# Altium schematic sheet Shaheen.SchDoc
size A2
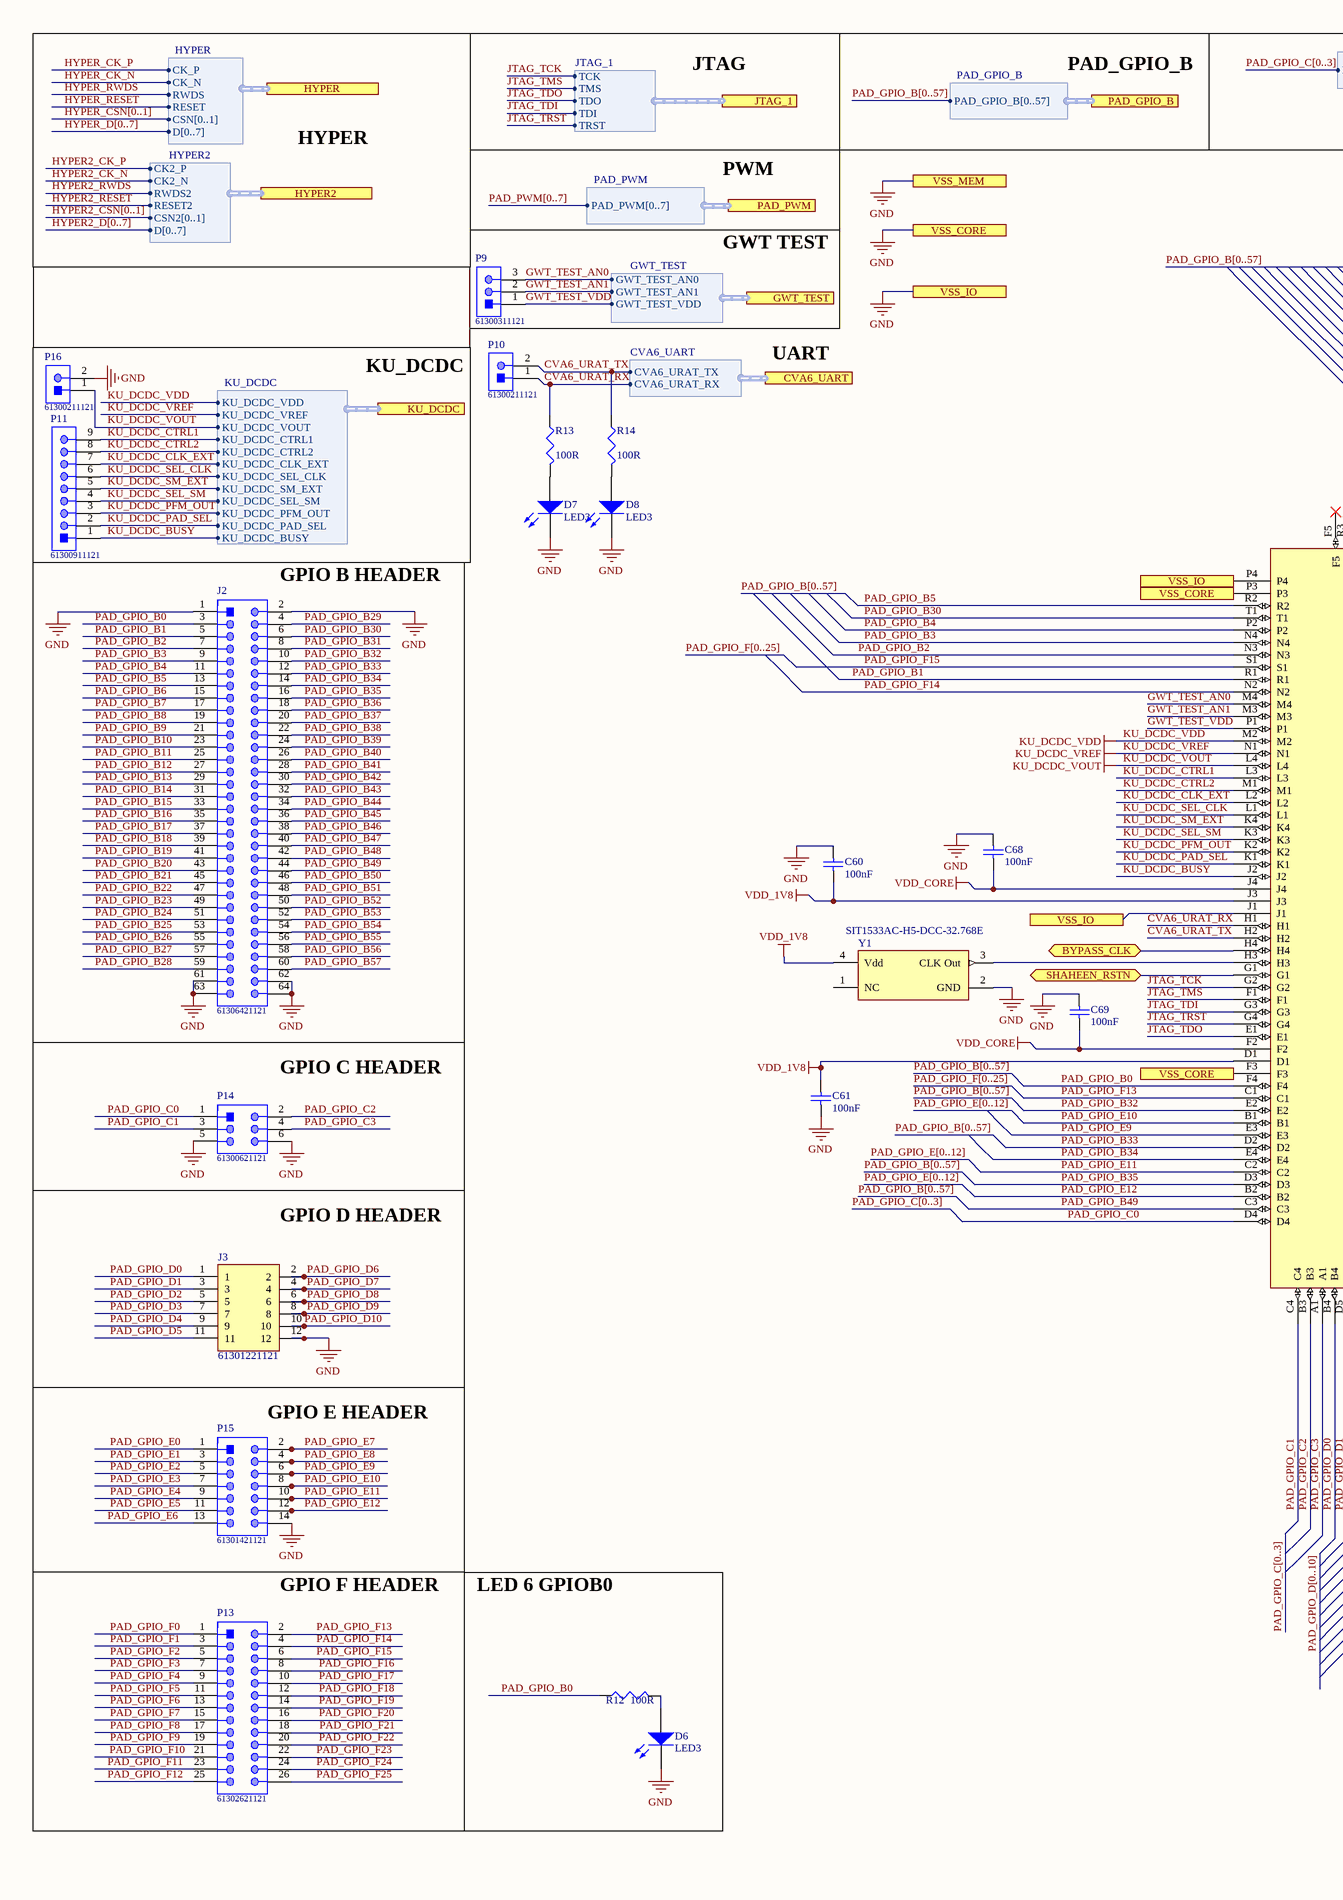
[diagram p0: Shaheen.SchDoc, left]
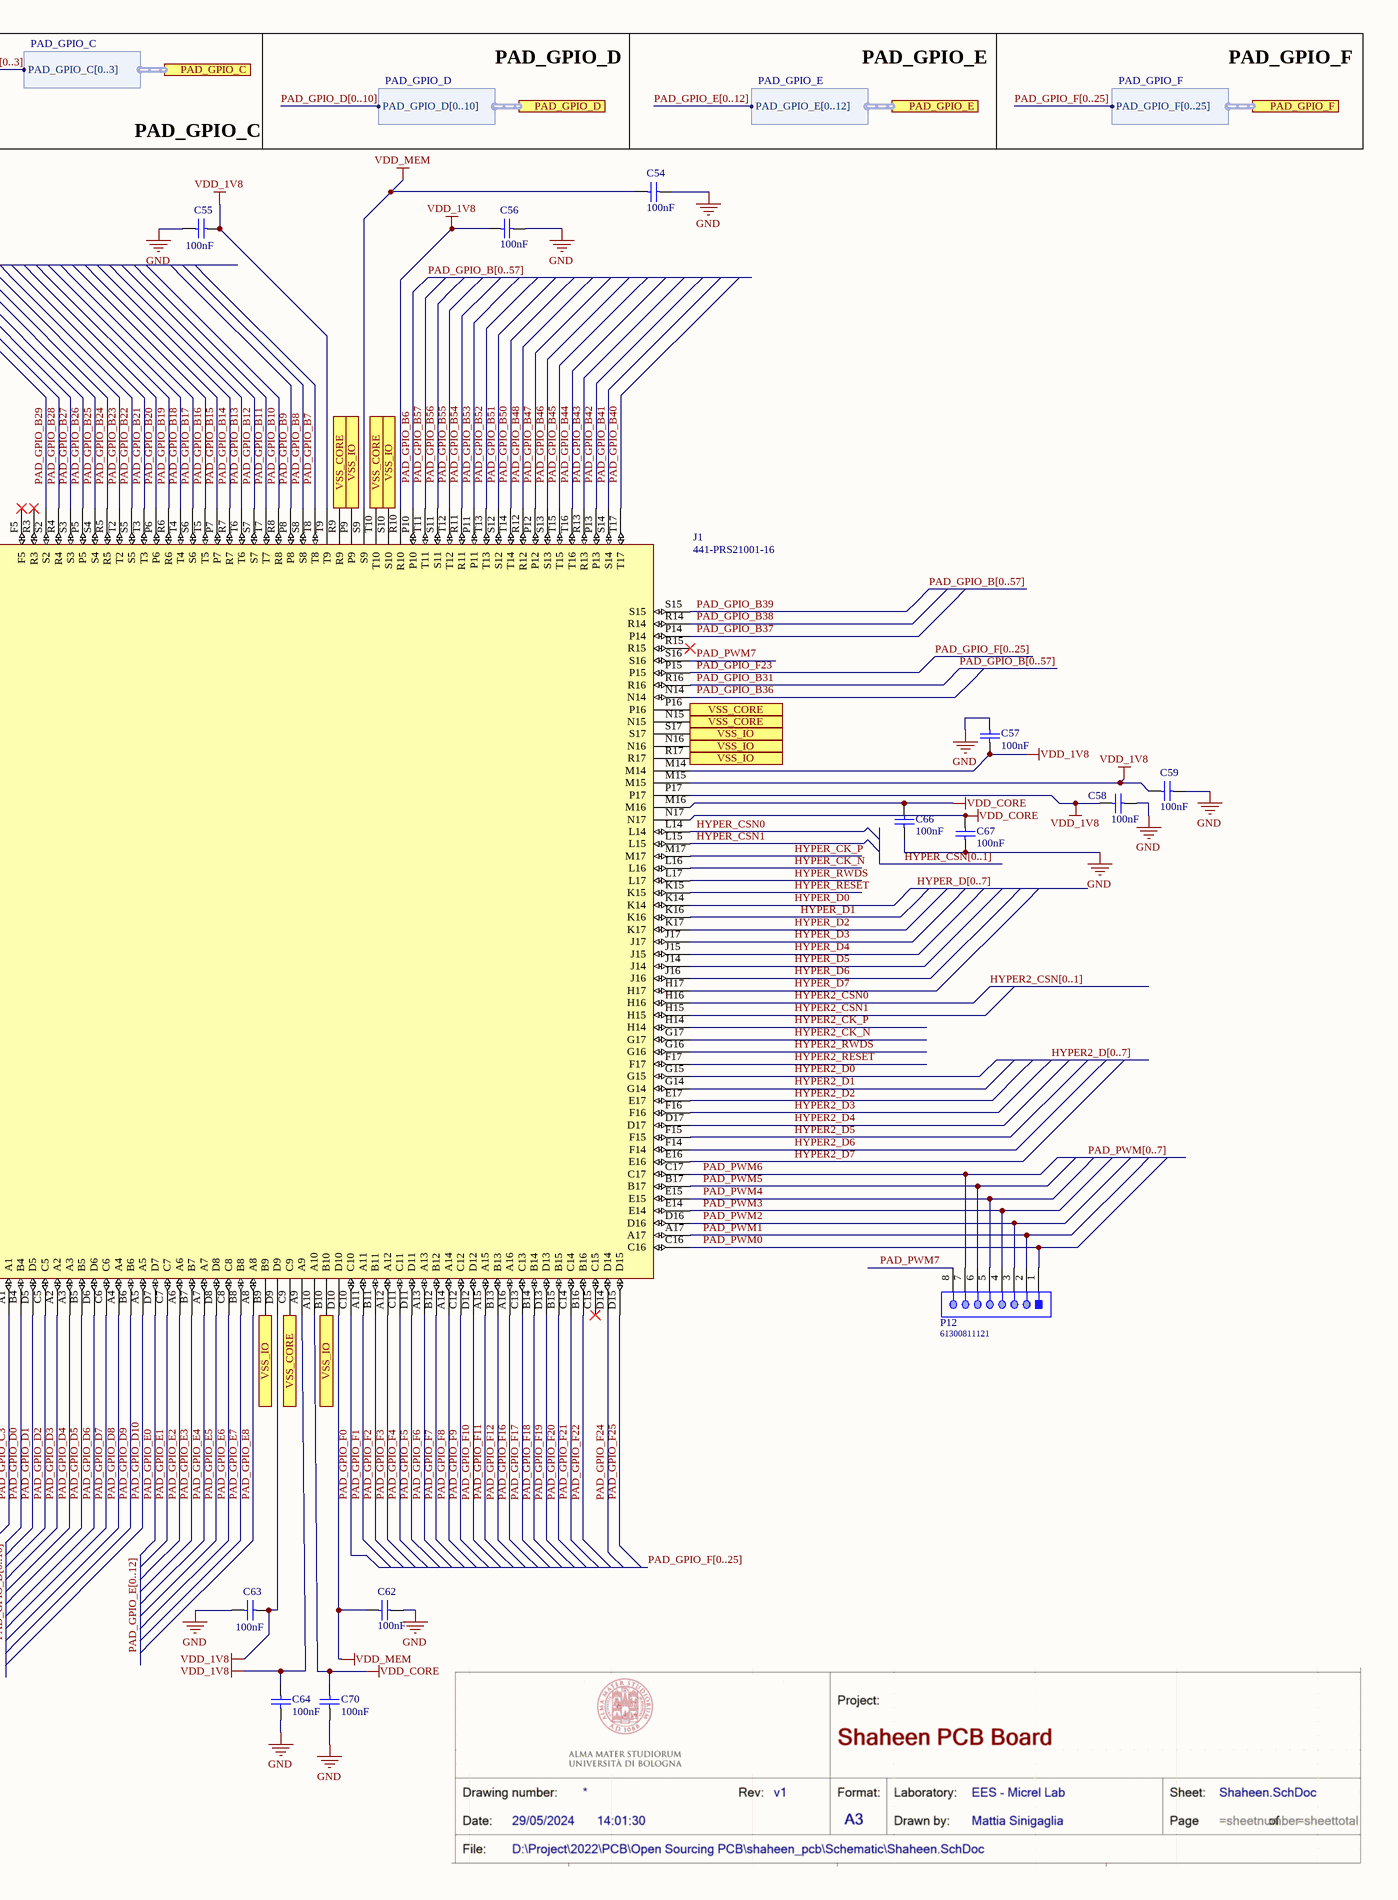
[diagram p1: Shaheen.SchDoc, right]

## Parts
C54  value 100nF  [0603]  (hidden comment: Cap)
C55  value 100nF  [0603]  (hidden comment: Cap)
C56  value 100nF  [0603]  (hidden comment: Cap)
C57  value 100nF  [0603]  (hidden comment: Cap)
C58  value 100nF  [0603]  (hidden comment: Cap)
C59  value 100nF  [0603]  (hidden comment: Cap)
C60  value 100nF  [0603]  (hidden comment: Cap)
C61  value 100nF  [0603]  (hidden comment: Cap)
C62  value 100nF  [0603]  (hidden comment: Cap)
C63  value 100nF  [0603]  (hidden comment: Cap)
C64  value 100nF  [0603]  (hidden comment: Cap)
C66  value 100nF  [0603]  (hidden comment: Cap)
C67  value 100nF  [0603]  (hidden comment: Cap)
C68  value 100nF  [0603]  (hidden comment: Cap)
C69  value 100nF  [0603]  (hidden comment: Cap)
C70  value 100nF  [0603]  (hidden comment: Cap)
D6  LED3  [0603]
D7  LED3  [0603]
D8  LED3  [0603]
J1  441-PRS21001-16  [441PRS2100116]
J2  61306421121  [61306421121]
J3  61301221121  [HDRV12W64P254_2X6_1524X508X889P]
P9  61300311121  [61300311121]
P10  61300211121  [61300211121]
P11  61300911121  [61300911121]
P12  61300811121  [61300811121]
P13  61302621121  [61302621121]
P14  61300621121  [61300621121]
P15  61301421121  [61301421121]
P16  61300211121  [61300211121]
R12  value 100R  [J1-0603]  (hidden comment: Res3)
R13  value 100R  [res_0402_R - modified]  (hidden comment: Res3)
R14  value 100R  [res_0402_R - modified]  (hidden comment: Res3)
Y1  SIT1533AC-H5-DCC-32.768E  [FP-SiT1533-H-MFG]

## Ports
BYPASS_CLK (bidir), CVA6_UART (harness CVA6_UART), GWT_TEST (harness GWT_TEST), HYPER2 (harness HYPER2), HYPER (harness HYPER), JTAG_1 (harness JTAG_1), KU_DCDC (harness KU_DCDC), PAD_GPIO_B (harness PAD_GPIO_B), PAD_GPIO_C (harness PAD_GPIO_C), PAD_GPIO_D (harness PAD_GPIO_D), PAD_GPIO_E (harness PAD_GPIO_E), PAD_GPIO_F (harness PAD_GPIO_F), PAD_PWM (harness PAD_PWM), SHAHEEN_RSTN (bidir), VSS_CORE, VSS_IO, VSS_MEM

## Harnesses
JTAG_1: TRST, TDI, TDO, TMS, TCK
HYPER2: D[0..7], CK2_P, CK2_N, RWDS2, CSN2[0..1], RESET2
HYPER: CK_N, CK_P, RWDS, CSN[0..1], D[0..7], RESET
CVA6_UART: CVA6_URAT_RX, CVA6_URAT_TX
PAD_GPIO_B: PAD_GPIO_B[0..57]
KU_DCDC: KU_DCDC_VDD, KU_DCDC_VREF, KU_DCDC_VOUT, KU_DCDC_CTRL1, KU_DCDC_CTRL2, KU_DCDC_CLK_EXT, KU_DCDC_SEL_CLK, KU_DCDC_SM_EXT, KU_DCDC_SEL_SM, KU_DCDC_PFM_OUT, KU_DCDC_PAD_SEL, KU_DCDC_BUSY
PAD_GPIO_C: PAD_GPIO_C[0..3]
PAD_GPIO_D: PAD_GPIO_D[0..10]
PAD_GPIO_E: PAD_GPIO_E[0..12]
PAD_GPIO_F: PAD_GPIO_F[0..25]
PAD_PWM: PAD_PWM[0..7]
GWT_TEST: GWT_TEST_VDD, GWT_TEST_AN1, GWT_TEST_AN0

## Nets
GND: C54.2 C55.2 C56.2 C57.2 C58.2 C59.1 C60.2 C61.2 C62.1 C63.2 C64.2 C66.1 C67.2 C68.2 C69.2 C70.2 D6.2(K) D7.2(K) D8.2(K) J1.B9 J1.B10 J1.C9 J1.F3 J1.J1 J1.N15 J1.N16 J1.P3 J1.P4 J1.P9 J1.P16 J1.R9 J1.R17 J1.S10 J1.S17 J1.T10 J2.1 J2.2 J2.61 J2.62 J2.63 J2.64 J3.12 P14.5 P14.6 P15.14 P16.2 Y1.2(GND) ; port VSS_MEM, port VSS_CORE, port VSS_IO
KU_DCDC_VDD: J1.M2 ; port KU_DCDC.KU_DCDC_VDD
KU_DCDC_VOUT: J1.L4 P16.1 ; port KU_DCDC.KU_DCDC_VOUT
KU_DCDC_VREF: J1.N1 ; port KU_DCDC.KU_DCDC_VREF
VDD_1V8: C55.1 C56.1 C57.1 C58.1 C59.2 C60.1 C61.1 C63.1 C64.1 J1.A9 J1.D1 J1.D9 J1.J3 J1.M14 J1.M15 J1.P17 J1.R10 J1.T9 Y1.4(Vdd)
VDD_CORE: C66.2 C67.1 C68.1 C69.1 C70.1 J1.A10 J1.F2 J1.J4 J1.M16 J1.N17
VDD_MEM: C54.1 C62.2 J1.D10 J1.S9
BYPASS_CLK: J1.H4 ; port BYPASS_CLK
CVA6_URAT_RX: J1.H1 P10.1 R13.1 ; port CVA6_UART.CVA6_URAT_RX
CVA6_URAT_TX: J1.H2 P10.2 R14.1 ; port CVA6_UART.CVA6_URAT_TX
GWT_TEST_AN0: J1.M4 P9.3 ; port GWT_TEST.GWT_TEST_AN0
GWT_TEST_AN1: J1.M3 P9.2 ; port GWT_TEST.GWT_TEST_AN1
GWT_TEST_VDD: J1.P1 P9.1 ; port GWT_TEST.GWT_TEST_VDD
HYPER2_CK_N: J1.G17 ; port HYPER2.CK2_N
HYPER2_CK_P: J1.H14 ; port HYPER2.CK2_P
HYPER2_CSN0: J1.H16
HYPER2_CSN1: J1.H15
HYPER2_D0: J1.G15
HYPER2_D1: J1.G14
HYPER2_D2: J1.E17
HYPER2_D3: J1.F16
HYPER2_D4: J1.D17
HYPER2_D5: J1.F15
HYPER2_D6: J1.F14
HYPER2_D7: J1.E16
HYPER2_RESET: J1.F17 ; port HYPER2.RESET2
HYPER2_RWDS: J1.G16 ; port HYPER2.RWDS2
HYPER_CK_N: J1.L16 ; port HYPER.CK_N
HYPER_CK_P: J1.M17 ; port HYPER.CK_P
HYPER_CSN0: J1.L14
HYPER_CSN1: J1.L15
HYPER_D0: J1.K14
HYPER_D1: J1.K16
HYPER_D2: J1.K17
HYPER_D3: J1.J17
HYPER_D4: J1.J15
HYPER_D5: J1.J14
HYPER_D6: J1.J16
HYPER_D7: J1.H17
HYPER_RESET: J1.K15 ; port HYPER.RESET
HYPER_RWDS: J1.L17 ; port HYPER.RWDS
JTAG_TCK: J1.G2 ; port JTAG_1.TCK
JTAG_TDI: J1.G3 ; port JTAG_1.TDI
JTAG_TDO: J1.E1 ; port JTAG_1.TDO
JTAG_TMS: J1.F1 ; port JTAG_1.TMS
JTAG_TRST: J1.G4 ; port JTAG_1.TRST
KU_DCDC_BUSY: J1.J2 P11.1 ; port KU_DCDC.KU_DCDC_BUSY
KU_DCDC_CLK_EXT: J1.L2 P11.7 ; port KU_DCDC.KU_DCDC_CLK_EXT
KU_DCDC_CTRL1: J1.L3 P11.9 ; port KU_DCDC.KU_DCDC_CTRL1
KU_DCDC_CTRL2: J1.M1 P11.8 ; port KU_DCDC.KU_DCDC_CTRL2
KU_DCDC_PAD_SEL: J1.K1 P11.2 ; port KU_DCDC.KU_DCDC_PAD_SEL
KU_DCDC_PFM_OUT: J1.K2 P11.3 ; port KU_DCDC.KU_DCDC_PFM_OUT
KU_DCDC_SEL_CLK: J1.L1 P11.6 ; port KU_DCDC.KU_DCDC_SEL_CLK
KU_DCDC_SEL_SM: J1.K3 P11.4 ; port KU_DCDC.KU_DCDC_SEL_SM
KU_DCDC_SM_EXT: J1.K4 P11.5 ; port KU_DCDC.KU_DCDC_SM_EXT
PAD_GPIO_B0: J1.F4 J2.3 R12.1
PAD_GPIO_B1: J1.R1 J2.5
PAD_GPIO_B2: J1.N3 J2.7
PAD_GPIO_B3: J1.N4 J2.9
PAD_GPIO_B4: J1.P2 J2.11
PAD_GPIO_B5: J1.R2 J2.13
PAD_GPIO_B6: J1.P10 J2.15
PAD_GPIO_B7: J1.T8 J2.17
PAD_GPIO_B8: J1.S8 J2.19
PAD_GPIO_B9: J1.P8 J2.21
PAD_GPIO_B10: J1.R8 J2.23
PAD_GPIO_B11: J1.T7 J2.25
PAD_GPIO_B12: J1.S7 J2.27
PAD_GPIO_B13: J1.T6 J2.29
PAD_GPIO_B14: J1.R7 J2.31
PAD_GPIO_B15: J1.P7 J2.33
PAD_GPIO_B16: J1.T5 J2.35
PAD_GPIO_B17: J1.S6 J2.37
PAD_GPIO_B18: J1.T4 J2.39
PAD_GPIO_B19: J1.R6 J2.41
PAD_GPIO_B20: J1.P6 J2.43
PAD_GPIO_B21: J1.T3 J2.45
PAD_GPIO_B22: J1.S5 J2.47
PAD_GPIO_B23: J1.T2 J2.49
PAD_GPIO_B24: J1.R5 J2.51
PAD_GPIO_B25: J1.S4 J2.53
PAD_GPIO_B26: J1.P5 J2.55
PAD_GPIO_B27: J1.S3 J2.57
PAD_GPIO_B28: J1.R4 J2.59
PAD_GPIO_B29: J1.S2 J2.4
PAD_GPIO_B30: J1.T1 J2.6
PAD_GPIO_B31: J1.R16 J2.8
PAD_GPIO_B32: J1.E2 J2.10
PAD_GPIO_B33: J1.D2 J2.12
PAD_GPIO_B34: J1.E4 J2.14
PAD_GPIO_B35: J1.D3 J2.16
PAD_GPIO_B36: J1.N14 J2.18
PAD_GPIO_B37: J1.P14 J2.20
PAD_GPIO_B38: J1.R14 J2.22
PAD_GPIO_B39: J1.S15 J2.24
PAD_GPIO_B40: J1.T17 J2.26
PAD_GPIO_B41: J1.S14 J2.28
PAD_GPIO_B42: J1.P13 J2.30
PAD_GPIO_B43: J1.R13 J2.32
PAD_GPIO_B44: J1.T16 J2.34
PAD_GPIO_B45: J1.T15 J2.36
PAD_GPIO_B46: J1.S13 J2.38
PAD_GPIO_B47: J1.P12 J2.40
PAD_GPIO_B48: J1.R12 J2.42
PAD_GPIO_B49: J1.C3 J2.44
PAD_GPIO_B50: J1.T14 J2.46
PAD_GPIO_B51: J1.S12 J2.48
PAD_GPIO_B52: J1.T13 J2.50
PAD_GPIO_B53: J1.P11 J2.52
PAD_GPIO_B54: J1.R11 J2.54
PAD_GPIO_B55: J1.T12 J2.56
PAD_GPIO_B56: J1.S11 J2.58
PAD_GPIO_B57: J1.T11 J2.60
PAD_GPIO_C0: J1.D4 P14.1
PAD_GPIO_C1: J1.C4 P14.3
PAD_GPIO_C2: J1.B3 P14.2
PAD_GPIO_C3: J1.A1 P14.4
PAD_GPIO_D0: J1.B4 J3.1
PAD_GPIO_D1: J1.D5 J3.3
PAD_GPIO_D2: J1.C5 J3.5
PAD_GPIO_D3: J1.A2 J3.7
PAD_GPIO_D4: J1.A3 J3.9
PAD_GPIO_D5: J1.B5 J3.11
PAD_GPIO_D6: J1.D6 J3.2
PAD_GPIO_D7: J1.C6 J3.4
PAD_GPIO_D8: J1.A4 J3.6
PAD_GPIO_D9: J1.B6 J3.8
PAD_GPIO_D10: J1.A5 J3.10
PAD_GPIO_E0: J1.D7 P15.1
PAD_GPIO_E1: J1.C7 P15.3
PAD_GPIO_E2: J1.A6 P15.5
PAD_GPIO_E3: J1.B7 P15.7
PAD_GPIO_E4: J1.A7 P15.9
PAD_GPIO_E5: J1.D8 P15.11
PAD_GPIO_E6: J1.C8 P15.13
PAD_GPIO_E7: J1.B8 P15.2
PAD_GPIO_E8: J1.A8 P15.4
PAD_GPIO_E9: J1.E3 P15.6
PAD_GPIO_E10: J1.B1 P15.8
PAD_GPIO_E11: J1.C2 P15.10
PAD_GPIO_E12: J1.B2 P15.12
PAD_GPIO_F0: J1.C10 P13.1
PAD_GPIO_F1: J1.A11 P13.3
PAD_GPIO_F2: J1.B11 P13.5
PAD_GPIO_F3: J1.A12 P13.7
PAD_GPIO_F4: J1.C11 P13.9
PAD_GPIO_F5: J1.D11 P13.11
PAD_GPIO_F6: J1.A13 P13.13
PAD_GPIO_F7: J1.B12 P13.15
PAD_GPIO_F8: J1.A14 P13.17
PAD_GPIO_F9: J1.C12 P13.19
PAD_GPIO_F10: J1.D12 P13.21
PAD_GPIO_F11: J1.A15 P13.23
PAD_GPIO_F12: J1.B13 P13.25
PAD_GPIO_F13: J1.C1 P13.2
PAD_GPIO_F14: J1.N2 P13.4
PAD_GPIO_F15: J1.S1 P13.6
PAD_GPIO_F16: J1.A16 P13.8
PAD_GPIO_F17: J1.C13 P13.10
PAD_GPIO_F18: J1.B14 P13.12
PAD_GPIO_F19: J1.D13 P13.14
PAD_GPIO_F20: J1.B15 P13.16
PAD_GPIO_F21: J1.C14 P13.18
PAD_GPIO_F22: J1.B16 P13.20
PAD_GPIO_F23: J1.P15 P13.22
PAD_GPIO_F24: J1.D14 P13.24
PAD_GPIO_F25: J1.D15 P13.26
PAD_PWM0: J1.C16 P12.1
PAD_PWM1: J1.A17 P12.2
PAD_PWM2: J1.D16 P12.3
PAD_PWM3: J1.E14 P12.4
PAD_PWM4: J1.E15 P12.5
PAD_PWM5: J1.B17 P12.6
PAD_PWM6: J1.C17 P12.7
PAD_PWM7: J1.S16 P12.8
SHAHEEN_RSTN: J1.G1 ; port SHAHEEN_RSTN
NetD6_1: D6.1(A) R12.2
NetD7_1: D7.1(A) R13.2
NetD8_1: D8.1(A) R14.2
NetJ1_H3: J1.H3 Y1.3(CLK_Out)

Not connected (* = marked no-connect by the designer): J1 C15* F5* R3* R15*; Y1 1(NC)

## Buses and harness runs
bus HYPER2_CSN[0..1]
bus HYPER2_D[0..7]
bus HYPER_CSN[0..1]
bus HYPER_D[0..7]
bus PAD_GPIO_B[0..57]
bus PAD_GPIO_C[0..3]
bus PAD_GPIO_D[0..10]
bus PAD_GPIO_E[0..12]
bus PAD_GPIO_F[0..25]
bus PAD_PWM[0..7]

## Notes on the sheet
- JTAG
- PAD_GPIO_B
- PAD_GPIO_D
- PAD_GPIO_E
- PAD_GPIO_F
- HYPER
- PAD_GPIO_C
- PWM
- GWT TEST
- KU_DCDC
- UART
- (near J2) GPIO B HEADER
- (near P14) GPIO C HEADER
- GPIO D HEADER
- (near P15) GPIO E HEADER
- GPIO F HEADER
- LED 6 GPIOB0

## Library data of the parts
C54-C64 C66-C70 = Cap: Capacitor; Published: 8-Jun-2000; LatestRevisionDate: 17-Jul-2002; LatestRevisionNote: Re-released for DXP Platform.; PackageReference: RAD-0.3; Publisher: Altium Limited; PackageDescription: Radial Cap, Thru-Hole; 2 Leads; 0.3 in Pin Spacing
D6-D8 = LED3: Typical BLUE SiC LED; Published: 8-Jun-2000; LatestRevisionDate: 17-Dec-2003; LatestRevisionNote: PCB Footprint replaced.; DatasheetVersion: 16-Apr-2002; PackageVersion: 16-Apr-2002; PackageReference: 3.5X2.8X1.9; Publisher: Altium Limited; PackageDescription: SM LED; 2 C-Bend Leads; Body 3.5 x 2.8 x 1.9 mm, inc leads (LxWxH typ)
J1 = 441-PRS21001-16: Connector; Manufacturer_Name: ARIES; Datasheet Link: https://www.mouser.it/datasheet/2/35/10004_pga_zif_test_and_burn_in_socket-1225760.pdf; Height: 10.92mm; Manufacturer_Part_Number: 441-PRS21001-16; Mouser Part Number: 535-441-PRS21001-16; Mouser Price/Stock: https://www.mouser.co.uk/ProductDetail/Aries-Electronics/441-PRS21001-16?qs=qSpSzuzdqG3uVfRDOHdDNQ%3D%3D
J2 = CMP-1502-01138-1: THT Vertical Pin Header WR-PHD, Pitch 2.54 mm, Dual Row, 64 pins; Manufacturer: Wurth Elektronik; Withstanding Voltage: 500VAC; Rated Current: 3A; Gender: Male; Pin Number: 64; Working Voltage: 250VAC; Contact Resistance: 20mOhm; Pitch: 2.54mm; Orientation: Vertical; Manufacturer URL: http://www.we-online.de; Package Reference: 61306421121; Operating Temperature: -40to105degC; Part Number: 61306421121; Row Number: Dual; Datasheet URL: https://katalog.we-online.de/em/datasheet/6130xx21121.pdf; Mounting Technology: THT; Publisher: WurthElektronik; Packaging: Bag
J3 = 61301221121: Connector; Manufacturer_Name: Wurth Elektronik; Datasheet Link: https://componentsearchengine.com//61301221121.pdf; Height: 8.89mm; Mouser2 Part Number: 710-61301221121; Mouser2 Price/Stock: https://www.mouser.com/Search/Refine.aspx?Keyword=710-61301221121; Manufacturer_Part_Number: 61301221121
P9 = CMP-1502-01062-1: THT Vertical Pin Header WR-PHD, Pitch 2.54 mm, Single Row, 3 pins; Manufacturer: Wurth Elektronik; Withstanding Voltage: 500VAC; Working Voltage: 250VAC; Rated Current: 3A; Pitch: 2.54mm; Pin Number: 3; Gender: Male; Contact Resistance: 20mOhm; Package Reference: 61300311121; Manufacturer URL: http://www.we-online.de; Datasheet URL: https://katalog.we-online.de/em/datasheet/6130xx11121.pdf; Operating Temperature: -40to105degC; Part Number: 61300311121; Orientation: Vertical; Packaging: Bag; Row Number: Single; Mounting Technology: THT; Publisher: WurthElektronik
P10 P16 = CMP-1712-00002-4: THT Vertical Pin Header WR-PHD, Pitch 2.54 mm, Single Row, 2 pins; Manufacturer: Wurth Elektronik; Rated Current: 3A; Gender: Male; Withstanding Voltage: 500VAC; Working Voltage: 250VAC; Pitch: 2.54mm; Contact Resistance: 20mOhm; Pin Number: 2; Mounting Technology: THT; Orientation: Vertical; Operating Temperature: -40to105degC; Packaging: Bag; Publisher: WurthElektronik; Datasheet URL: https://katalog.we-online.de/em/datasheet/6130xx11121.pdf; Manufacturer URL: http://www.we-online.de; Row Number: Single; Package Reference: 61300211121; Part Number: 61300211121
P11 = CMP-1502-01080-1: THT Vertical Pin Header WR-PHD, Pitch 2.54 mm, Single Row, 9 pins; Manufacturer: Wurth Elektronik; Pitch: 2.54mm; Gender: Male; Working Voltage: 250VAC; Contact Resistance: 20mOhm; Withstanding Voltage: 500VAC; Pin Number: 9; Rated Current: 3A; Package Reference: 61300911121; Part Number: 61300911121; Mounting Technology: THT; Publisher: WurthElektronik; Manufacturer URL: http://www.we-online.de; Orientation: Vertical; Datasheet URL: https://katalog.we-online.de/em/datasheet/6130xx11121.pdf; Operating Temperature: -40to105degC; Row Number: Single; Packaging: Bag
P12 = CMP-1502-01076-1: THT Vertical Pin Header WR-PHD, Pitch 2.54 mm, Single Row, 8 pins; Manufacturer: Wurth Elektronik; Rated Current: 3A; Pin Number: 8; Working Voltage: 250VAC; Gender: Male; Contact Resistance: 20mOhm; Pitch: 2.54mm; Withstanding Voltage: 500VAC; Publisher: WurthElektronik; Operating Temperature: -40to105degC; Orientation: Vertical; Row Number: Single; Part Number: 61300811121; Package Reference: 61300811121; Mounting Technology: THT; Packaging: Bag; Manufacturer URL: http://www.we-online.de; Datasheet URL: https://katalog.we-online.de/em/datasheet/6130xx11121.pdf
P13 = CMP-1502-01114-1: THT Vertical Pin Header WR-PHD, Pitch 2.54 mm, Dual Row, 26 pins; Manufacturer: Wurth Elektronik; Pin Number: 26; Withstanding Voltage: 500VAC; Working Voltage: 250VAC; Contact Resistance: 20mOhm; Pitch: 2.54mm; Rated Current: 3A; Gender: Male; Package Reference: 61302621121; Manufacturer URL: http://www.we-online.de; Row Number: Dual; Packaging: Bag; Publisher: WurthElektronik; Datasheet URL: https://katalog.we-online.de/em/datasheet/6130xx21121.pdf; Operating Temperature: -40to105degC; Mounting Technology: THT; Orientation: Vertical; Part Number: 61302621121
P14 = CMP-1502-01072-1: THT Vertical Pin Header WR-PHD, Pitch 2.54 mm, Dual Row, 6 pins; Manufacturer: Wurth Elektronik; Contact Resistance: 20mOhm; Withstanding Voltage: 500VAC; Pin Number: 6; Gender: Male; Pitch: 2.54mm; Working Voltage: 250VAC; Rated Current: 3A; Packaging: Bag; Row Number: Dual; Manufacturer URL: http://www.we-online.de; Part Number: 61300621121; Operating Temperature: -40to105degC; Mounting Technology: THT; Package Reference: 61300621121; Datasheet URL: https://katalog.we-online.de/em/datasheet/6130xx21121.pdf; Orientation: Vertical; Publisher: WurthElektronik
P15 = CMP-1502-01093-1: THT Vertical Pin Header WR-PHD, Pitch 2.54 mm, Dual Row, 14 pins; Manufacturer: Wurth Elektronik; Rated Current: 3A; Withstanding Voltage: 500VAC; Gender: Male; Pin Number: 14; Pitch: 2.54mm; Working Voltage: 250VAC; Contact Resistance: 20mOhm; Mounting Technology: THT; Orientation: Vertical; Packaging: Bag; Part Number: 61301421121; Manufacturer URL: http://www.we-online.de; Datasheet URL: https://katalog.we-online.de/em/datasheet/6130xx21121.pdf; Operating Temperature: -40to105degC; Package Reference: 61301421121; Publisher: WurthElektronik; Row Number: Dual
R12-R14 = Res3: Resistor; Published: 8-Jun-2000; LatestRevisionDate: 29-May-2009; LatestRevisionNote: IPC-7351 Footprint Added.; PackageReference: J1-0603; Publisher: Altium Limited; PackageDescription: Chip Resistor
Y1 = CMP-25159-260609-1: MEMS OSC XO 32.7680KHZ LVCMOS; Frequency Stability: 75ppm; Max Supply Current: 1.3uA; Frequency: 32.768kHz; Min Operating Temperature: -10°C; Series: SiT1533; Height: 0.024inch; Packaging: Cut Tape; Case/Package: SMD/SMT; Max Operating Temperature: 70°C; RoHS Compliant: Yes; Length: 0.079inch; Width: 0.047inch; Mount: Surface Mount; Number of Pins: 4